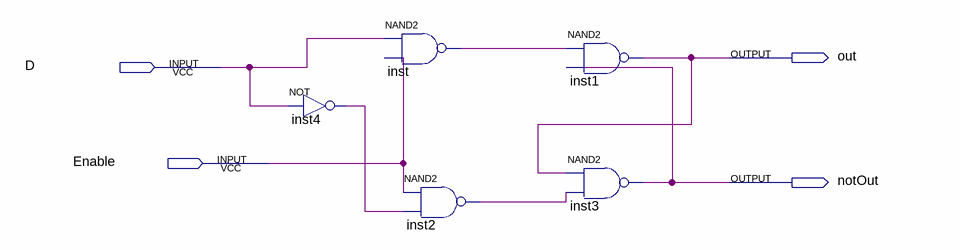
[diagram p0: schematic sheet]
// Quartus schematic reg1.bdf as structural Verilog: 5 symbols, 4 pins
module reg1 (
  input  D,
  input  Enable,
  output out,
  output notOut
);

  wire inst2_out, inst4_out, inst_out;

  not inst4 (inst4_out, D);
  nand inst (inst_out, D, Enable);
  nand inst2 (inst2_out, Enable, inst4_out);
  nand inst1 (out, inst_out, notOut);
  nand inst3 (notOut, out, inst2_out);
endmodule
